# Altium project AirSenseV2_03.PrjPcb
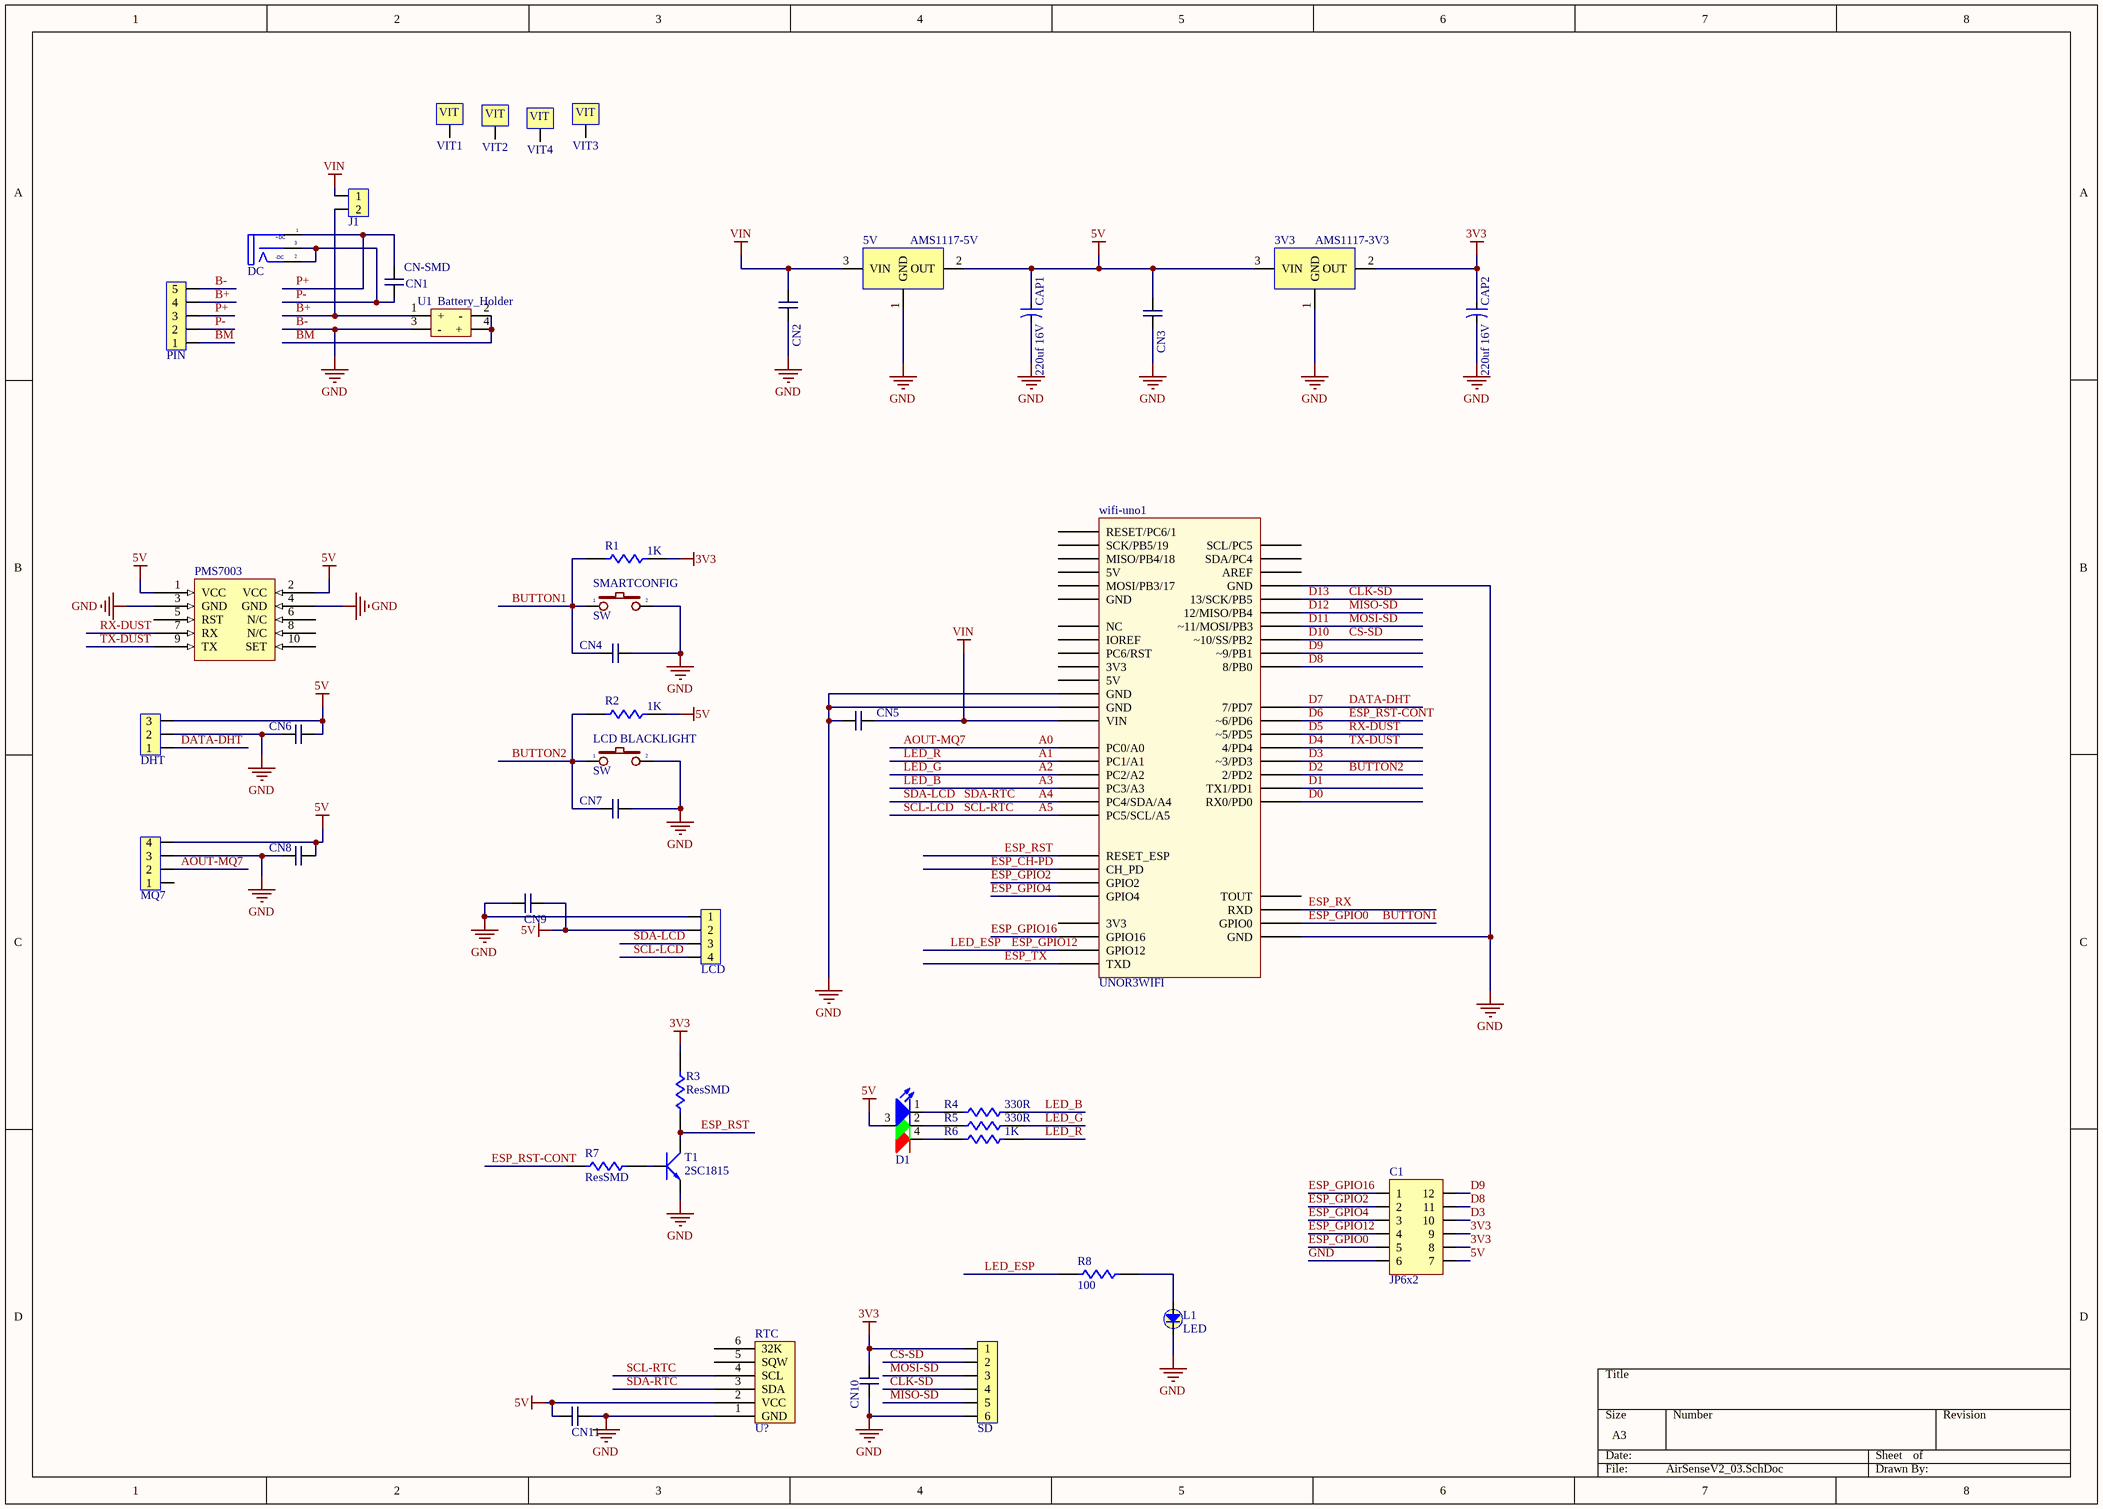
[diagram p0: AirSenseV2_03.SchDoc]
1 sheet, 44 parts. Net scope: global (net labels, ports and power ports of the same name join across sheets).
Board file: AirSenseV2_03.PcbDoc

## Sheet AirSenseV2_03.SchDoc
size A3

### Parts
3V3  AMS1117-3V3  [SOT223]
5V  AMS1117-5V  [SOT223]
C1  JP6x2  [JP6-D2T]
CAP1  220uf 16V  [CA-6.5x6.5]
CAP2  220uf 16V  [CA-6.5x6.5]
CN1  CN-SMD  [C-0805]
CN2  CN-SMD  [C-0805]  (value not drawn)
CN3  CN-SMD  [C-0805]  (value not drawn)
CN4  CN-SMD  [C-0805]  (value not drawn)
CN5  CN-SMD  [C-0805]  (value not drawn)
CN6  CN-SMD  [C-0805]  (value not drawn)
CN7  CN-SMD  [C-0805]  (value not drawn)
CN8  CN-SMD  [C-0805]  (value not drawn)
CN9  CN-SMD  [C-0805]  (value not drawn)
CN10  CN-SMD  [C-0805]  (value not drawn)
CN11  CN-SMD  [C-0805]  (value not drawn)
D1  LED_RGB1  [LED RGB 5MM TYPE A]  (value not drawn)
DC  DCIN  [DC0]  (value not drawn)
DHT  Header3  [Header3]  (value not drawn)
J1  JP2  [JP2-C1T]  (value not drawn)
L1  LED  [L-3B]
LCD  JP4  [JP4-C1T]  (value not drawn)
LCD_BLACKLIGHT  SW  [SW1-DIP]
MQ7  Header4  [Header4]  (value not drawn)
PIN  JP5  [JP5-D1T]  (value not drawn)
PMS7003  (no value)  [DUST_PMSA003]
R1  1K  [R0805]
R2  1K  [R0805]
R3  ResSMD  [R0805]
R4  330R  [R0805]
R5  330R  [R0805]
R6  1K  [R0805]
R7  ResSMD  [R0805]
R8  100  [R0805]
RTC  U?  [RTC_Module]
SD  JP6  [JP6-D1T]  (value not drawn)
SMARTCONFIG  SW  [SW1-DIP]
T1  2SC1815  [SOT23-BCE]
U1  Battery_Holder  [18650x2]
VIT1  VIT  [VIT]  (value not drawn)
VIT2  VIT  [VIT]  (value not drawn)
VIT3  VIT  [VIT]  (value not drawn)
VIT4  VIT  [VIT]  (value not drawn)
wifi-uno1  UNOR3WIFI  [UNOR3WIFI]

### Nets
3V3: 3V3.2(OUT) C1.8 C1.9 CAP2.1 CN10.2 R1.1 R3.1 SD.1
5V: 3V3.3(VIN) 5V.2(OUT) C1.7 CAP1.1 CN3.2 CN6.2 CN8.2 CN9.2 CN11.1 D1.3(A) DHT.3 LCD.2 MQ7.4 PMS7003.1(VCC) PMS7003.2(VCC) R2.1 RTC.2(VCC)
B-: 3V3.1(GND) 5V.1(GND) C1.6 CAP1.2 CAP2.2 CN2.1 CN3.1 CN4.2 CN5.1 CN6.1 CN7.2 CN8.1 CN9.1 CN10.1 CN11.2 DHT.2 L1.2(K) LCD.1 LCD_BLACKLIGHT.2 MQ7.3 PIN.5 PMS7003.3(GND) PMS7003.4(GND) RTC.1(GND) SD.6 SMARTCONFIG.2 T1.3(E) U1.3(-) wifi-uno1.GND  [also labelled GND]
VIN: 5V.3(VIN) CN2.2 CN5.2 J1.1 wifi-uno1.VIN
A0: MQ7.2 wifi-uno1.PC0(PC0/A0)  [also labelled AOUT-MQ7]
A1: R6.1 wifi-uno1.PC1(PC1/A1)  [also labelled LED_R]
A2: R5.1 wifi-uno1.PC2(PC2/A2)  [also labelled LED_G]
A3: R4.1 wifi-uno1.PC3(PC3/A3)  [also labelled LED_B]
A4: LCD.3 RTC.3(SDA) wifi-uno1.PC4(PC4/SDA/A4)  [also labelled SDA-LCD, SDA-RTC]
A5: LCD.4 RTC.4(SCL) wifi-uno1.PC5(PC5/SCL/A5)  [also labelled SCL-LCD, SCL-RTC]
B+: J1.2 PIN.4 U1.1(+)
BM: PIN.1 U1.2(-) U1.4(+)
BUTTON1: C1.5 CN4.1 R1.2 SMARTCONFIG.1 wifi-uno1.GPIO0  [also labelled ESP_GPIO0]
BUTTON2: CN7.1 LCD_BLACKLIGHT.1 R2.2 wifi-uno1.PD2(2/PD2)  [also labelled D2]
CLK-SD: SD.4 wifi-uno1.PB5(13/SCK/PB5)  [also labelled D13]
CS-SD: SD.2 wifi-uno1.PB2(~10/SS/PB2)  [also labelled D10]
D0: wifi-uno1.PD0(RX0/PD0)
D1: wifi-uno1.PD1(TX1/PD1)
D3: C1.10 wifi-uno1.PD3(~3/PD3)
D4: PMS7003.9(TX) wifi-uno1.PD4(4/PD4)  [also labelled TX-DUST]
D5: PMS7003.7(RX) wifi-uno1.PD5(~5/PD5)  [also labelled RX-DUST]
D6: R7.2 wifi-uno1.PD6(~6/PD6)  [also labelled ESP_RST-CONT]
D7: DHT.1 wifi-uno1.PD7(7/PD7)  [also labelled DATA-DHT]
D8: C1.11 wifi-uno1.PB0(8/PB0)
D9: C1.12 wifi-uno1.PB1(~9/PB1)
D11: SD.3 wifi-uno1.PB3(~11/MOSI/PB3)  [also labelled MOSI-SD]
D12: SD.5 wifi-uno1.PB4(12/MISO/PB4)  [also labelled MISO-SD]
ESP_CH-PD: wifi-uno1.CH_PD
ESP_GPIO2: C1.2 wifi-uno1.GPIO2
ESP_GPIO4: C1.3 wifi-uno1.GPIO4
ESP_GPIO12: C1.4 R8.1 wifi-uno1.GPIO12  [also labelled LED_ESP]
ESP_GPIO16: C1.1 wifi-uno1.GPIO16
ESP_RST: R3.2 T1.2(C) wifi-uno1.RESET_ESP
ESP_RX: wifi-uno1.RXD
ESP_TX: wifi-uno1.TXD
P+: CN1.2 DC.1(T) PIN.3
P-: CN1.1 DC.2(TN) DC.3(S) PIN.2
NetD1_1: D1.1(K_B) R4.2
NetD1_2: D1.2(K_G) R5.2
NetD1_4: D1.4(K_R) R6.2
NetL1_1: L1.1(A) R8.2
NetR7_1: R7.1 T1.1(B)

Not connected (* = marked no-connect by the designer): MQ7 1; PMS7003 5(RST) 6(N/C) 8(N/C) 10(SET); RTC 5(SQW) 6(32K); VIT1 VIT1(1); VIT2 VIT1(1); VIT3 VIT1(1); VIT4 VIT1(1); wifi-uno1 3V3 5V AREF IOREF NC PC6(RESET/PC6/1) TOUT

### Notes on the sheet
- (in symbol DCIN) +DC; -DC

### Library data of the parts
3V3 5V = AMS1117-3V3: 800mA Low-Dropout Linear Regulator
C1 = JP6x2: WR-PHD 2.54 mm Dual Socket Header; Manufacturer: W¨¹rth Elektronik eiSos GmbH; partNo: 61301221821; ComponentLink1 Description: Manufacturer; ComponentLink2 Description: Datasheet; NoPins: 12; Created Date: 29 March 2013; ComponentLink1URL: http://www.we-online.com; ComponentLink2URL: http://katalog.we-online.de/em/datasheet/6130xx21821.pdf; Created by: Karrer Zheng
CAP1 CAP2 = CAP-SMD: Cap Aluminum Lytic 100uF 10V 20% (8 X 6.2mm) SMD 230mA 1000h 105C Embossed T/R
CN1-CN11 = CN-SMD: CAP CER 0.047UF 25V X7R 040
DC = DCIN: CONN POWER JACK 2.1X5.5MM SMD
DHT = Header3: Header IDC, 3 x 1 Pin Vertical 2.54mm Pitch (Non-Boxed, Male)
J1 = JP2: WR-PHD 2.54 mm Angled Socket Header
L1 = LED: DIALIGHT         5988270107F            LED, Green, SMD, 20 mA, 2 V, 570 nm
LCD = JP4: WR-PHD 2.54 mm Angled Socket Header
LCD_BLACKLIGHT SMARTCONFIG = SW2: Switch button 2 pin; Value: SW chip 2 pin
MQ7 = Header4: Header IDC, 4 x 1 Pin Vertical 2.54mm Pitch (Non-Boxed, Male)
PIN = JP5: WR-PHD 2.54 mm Angled Socket Header
PMS7003 = DUST_PMSA003
R1-R8 = ResSMD: RES SMD 0.0 OHM JUMPER 1/8W 0805
RTC = RTC-Module
SD = JP6: WR-PHD 2.54 mm Angled Socket Header
T1 = 2SC1815: Bipolar Transistors - BJT NPN Epitaxial Sil
VIT1-VIT4 = VIT: Oc Vit